# Altium schematic sheet power-supply-hw.SchDoc
size A4; DrawnBy: Rogério J. Marcondeli / Samuel C. Z. Fraga
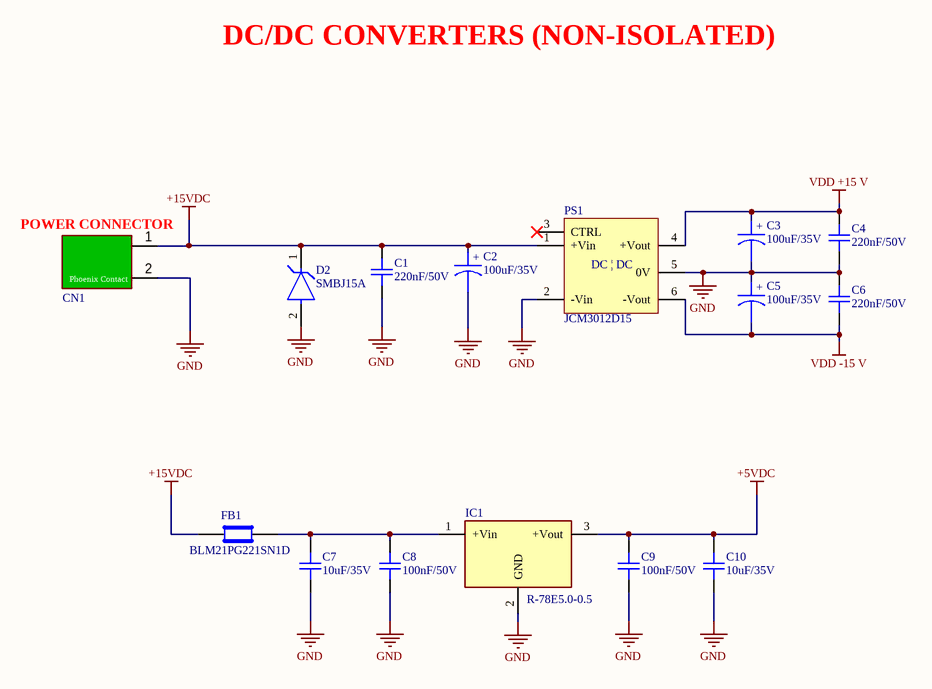
[diagram p0: power-supply-hw.SchDoc]

## Parts
C1  220nF/50V  [C0805]
C2  100uF/35V  [CAP_ALUM_case_D8]
C3  100uF/35V  [CAP_ALUM_case_D8]
C4  220nF/50V  [C0805]
C5  100uF/35V  [CAP_ALUM_case_D8]
C6  220nF/50V  [C0805]
C7  10uF/35V  [C0805]
C8  100nF/50V  [C0805]
C9  100nF/50V  [C0805]
C10  10uF/35V  [C0805]
CN1  1755736  [Conector Phoenix 2 vias 1755736]  (value not drawn)
D2  SMBJ15A  [FP-SMBJ-MFG]
FB1  BLM21PG221SN1D  [Ferrite_Bead_0805]
IC1  R-78E5.0-0.5  [R-78E5.0-0.5]
PS1  JCM3012D15  [JCM30]

## Nets
+5VDC: C9.2 C10.2 IC1.3(+Vout)
+15VDC: C1.2 C2.1(Lid_+) CN1.1 D2.1(C) FB1.1 PS1.1(+Vin)
GND: C1.1 C2.2 C3.2 C4.1 C5.1(Lid_+) C6.1 C7.1 C8.1 C9.1 C10.1 CN1.2 D2.2(A) IC1.2(GND) PS1.2(-Vin) PS1.5(0V)
VDD +15 V: C3.1(Lid_+) C4.2 PS1.4(+Vout)
VDD -15 V: C5.2 C6.2 PS1.6(-Vout)
NetC7_2: C7.2 C8.2 FB1.2 IC1.1(+Vin)

Not connected (* = marked no-connect by the designer): PS1 3(CTRL)*

## Notes on the sheet
- DC/DC CONVERTERS (NON-ISOLATED)
- (near CN1) POWER CONNECTOR
- Authors:
- Title:
- Revision:
- File:
- Project:
- Date:
- Variant:
- Sheet
- of
- DAT - INE - EMI
  Eletrônica e
  Microeletrônica
- (in symbol CAPACITOR 100uF/35V) +
- (in symbol JCM3012D15) DC | DC

## Library data of the parts
C1 C4 C6 = CAPACITOR 220nF/50V: Capacitor 220NF 50V X7R 0805; Manufacturer: Murata; Manufacturer Part Number: GRM21BR71H224MA01L; Tolerance: 20%; Código LNLS: AP112018; Supplier 1: Digi-Key; RoHS: Yes; Category: Ceramic Capacitors; Stock 1: 27774; Pricing 1: 1=0,37000, 10=0,25200, 50=0,16800, 100=0,14270, 500=0,10074, 1000=0,08815 (USD); Mount: Surface Mount; Case/Package: 0805; Case Code (Metric): 2012; Case Code (Imperial): 0805; Min Operating Temperature: -55°C; Max Operating Temperature: 125°C; Package Quantity: 1; Capacitance: 220nF; Packaging: Tape and Reel; Voltage Rating: 50V; Dielectric: X7R; Termination: SMD/SMT; Voltage Rating (DC): 50V; Series: GRM; Construction: Flat; Length: 2mm; Width: 0.049inch; Height: 1.25mm; Thickness: 0.053inch; Depth: 1.25mm; Radiation Hardening: No; Lead Free: Lead Free; RoHS Compliant: Yes; ComponentLink1URL: https://datasheet.ciiva.com/5421/product-5421097.pdf?src-supplier=Mouser; ComponentLink1Description: https://datasheet.ciiva.com/5421/product-5421097.pdf?src-supplier=Mouser; ComponentLink2URL: https://datasheet.ciiva.com/136/partnumbering-e-01-136537.pdf?src-supplier=Digi-Key; ComponentLink2Description: https://datasheet.ciiva.com/136/partnumbering-e-01-136537.pdf?src-supplier=Digi-Key; ComponentLink3URL: https://datasheet.ciiva.com/136/partnumbering-e-01-136536.pdf?src-supplier=Digi-Key; ComponentLink3Description: https://datasheet.ciiva.com/136/partnumbering-e-01-136536.pdf?src-supplier=Digi-Key; ComponentLink4URL: https://datasheet.ciiva.com/136/partnumbering-e-01-136538.pdf?src-supplier=Digi-Key; ComponentLink4Description: https://datasheet.ciiva.com/136/partnumbering-e-01-136538.pdf?src-supplier=Digi-Key; Supplier Part Number 1: 490-1671-1-ND
C2 C3 C5 = CAPACITOR 100uF/35V: Capacitor Alum 100UF 35V 20% SMD - EEE-HAV101XAP; Manufacturer: Panasonic; Capacitance: 100µF; Lifetime @ Temp.: 1000 Hrs @ 105°C; Ripple Current: 84mA; Surface Mount Land Size: 0.260" L x 0.260" W (6.60mm x 6.60mm); Código LNLS: AP105066; Part Number: EEE-HAV101XAP; Supplier 1: Digi-Key; Supplier Part Number 1: PCE4726CT-ND; Value: 100uF; Manufacturer Part Number: EEE-HAV101XAP; RoHS: RoHS Compliant; Category: Capacitors; Stock 1: 1957; Pricing 1: 1=0.63, 50=0.3758, 100=0.3289, 250=0.2584, 500=0.2349 (USD); Packaging: Cut Tape (CT); Tolerance: ±20%; Voltage Rating: 35V; ESR (Equivalent Series Resistance): -; Operating Temperature: -40°C ~ 105°C; Type: -; Applications: Automotive; Impedance: -; Lead Spacing: -; Size / Dimension: 0.248" Dia (6.30mm); Height - Seated (Max): 0.303" (7.70mm); Mounting Type: Surface Mount; Package / Case: Radial, Can - SMD; ComponentLink1URL: http://industrial.panasonic.com/www-cgi/jvcr13pz.cgi?E+PZ+3+ABA0116+EEEHAV101XAP+7+WW; ComponentLink1Description: http://industrial.panasonic.com/www-cgi/jvcr13pz.cgi?E+PZ+3+ABA0116+EEEHAV101XAP+7+WW
C7 C10 = CAPACITOR 10uF/35V: Capacitor 10UF 35V X5R 0805; Manufacturer: TDK; Manufacturer Part Number: C2012X5R1V106K085AC; Dielectric Material: Ceramic; Tolerance: 10%; Código LNLS: AP105062; Supplier 1: Digi-Key; Stock 1: 56135; Pricing 1: 1=0.73, 10=0.519, 100=0.3416, 500=0.253, 1000=0.2151 (USD); Case/Package: 0805; Weight: 0.000194oz; Case Code (Metric): 2012; Case Code (Imperial): 0805; Min Operating Temperature: -55°C; Max Operating Temperature: 85°C; Package Quantity: 1; Packaging: Tape and Reel; Capacitance: 10uF; Voltage Rating: 35V; Dielectric: X5R; Termination: SMD/SMT; Voltage Rating (DC): 35V; Length: 0.079inch; Height: 0.85mm; Width: 0.049inch; Thickness: 0.039inch; REACH SVHC: No SVHC; Lead Free: Lead Free; ComponentLink1URL: https://datasheet.ciiva.com/14894/tdkmlcccaprange-14894527.pdf; ComponentLink1Description: https://datasheet.ciiva.com/14894/tdkmlcccaprange-14894527.pdf; Supplier Part Number 1: 445-14417-1-ND
C8 C9 = CAPACITOR 100nF/50V: Capacitor 0.1UF 50V X7R 0805; Manufacturer 1: Kyocera AVX; Manufacturer Part Number 1: 08055C104KAZ2A; Description 1: Capacitor Ceramic 0.1uF 50V X7R 10% SMD 0805 FlexiTerm 125C Paper T/R; Category 1: Ceramic Capacitors; Capacitance: 100nF; Tolerance: 10%; Temperature Coefficient: 30ppm/°C; Dissipation Factor: 2.5%; Código LNLS: AP106675; Supplier 1: Arrow Electronics; Supplier Part Number 1: 08055C104KAZ2A; RoHS 1: Yes; Stock 1: 28000; Pricing 1: 4000=0,0262 (USD); Mount: Surface Mount,PCB; Case/Package: 0805; Number of Pins: 2; Case Code (Metric): 2012; Case Code (Imperial): 0805; Min Operating Temperature: -55°C; Max Operating Temperature: 125°C; Packaging: Tape and Reel; Voltage Rating (DC): 50V; Dielectric: X7R; Package Quantity: 4000; Series: FLEXITERM®; Voltage Rating: 50V; Termination: SMD/SMT; Voltage: 50V; Features: Soft Termination; Construction: Flat; Length: 2.01mm; Width: 1.25mm; Height: 0.94mm; Depth: 1.25mm; Reach SVHC Compliant: No; Lead Free: Lead Free; RoHS Compliant: Yes; ComponentLink1URL: https://datasheet.ciiva.com/28613/630895-28613376.pdf?src-supplier=Element14; ComponentLink1Description: https://datasheet.ciiva.com/28613/630895-28613376.pdf?src-supplier=Element14; ComponentLink2URL: https://datasheet.ciiva.com/11788/0900766b80dc2409-11788550.pdf?src-supplier=Rs; ComponentLink2Description: https://datasheet.ciiva.com/11788/0900766b80dc2409-11788550.pdf?src-supplier=Rs; ComponentLink3URL: https://datasheet.ciiva.com/30514/2014094-30514066.pdf?src-supplier=Jameco; ComponentLink3Description: https://datasheet.ciiva.com/30514/2014094-30514066.pdf?src-supplier=Jameco; ComponentLink4URL: https://datasheet.ciiva.com/11499/flexiterm-11499901.pdf?src-supplier=Avnet; ComponentLink4Description: https://datasheet.ciiva.com/11499/flexiterm-11499901.pdf?src-supplier=Avnet; ComponentLink5URL: https://datasheet.ciiva.com/5417/cx7r-218113-5417323.pdf?src-supplier=Mouser; ComponentLink5Description: https://datasheet.ciiva.com/5417/cx7r-218113-5417323.pdf?src-supplier=Mouser; ComponentLink6URL: https://datasheet.ciiva.com/28613/630895-28613368.pdf?src-supplier=Element14; ComponentLink6Description: https://datasheet.ciiva.com/28613/630895-28613368.pdf?src-supplier=Element14; ComponentLink7URL: https://datasheet.ciiva.com/151/flexiterm-151512.pdf?src-supplier=Digi-Key; ComponentLink7Description: https://datasheet.ciiva.com/151/flexiterm-151512.pdf?src-supplier=Digi-Key; ComponentLink8URL: https://datasheet.ciiva.com/151/flexiterm-151513.pdf?src-supplier=Digi-Key; ComponentLink8Description: https://datasheet.ciiva.com/151/flexiterm-151513.pdf?src-supplier=Digi-Key; ComponentLink9URL: https://datasheet.ciiva.com/151/flexiterm-151514.pdf?src-supplier=Digi-Key; ComponentLink9Description: https://datasheet.ciiva.com/151/flexiterm-151514.pdf?src-supplier=Digi-Key; ComponentLink10URL: https://datasheet.ciiva.com/14602/70001075-14602617.pdf?src-supplier=Allied+Electronics; ComponentLink10Description: https://datasheet.ciiva.com/14602/70001075-14602617.pdf?src-supplier=Allied+Electronics; ComponentLink11URL: https://datasheet.ciiva.com/16427/cx7r-16427406.pdf?src-supplier=Future+Electronics; ComponentLink11Description: https://datasheet.ciiva.com/16427/cx7r-16427406.pdf?src-supplier=Future+Electronics
CN1 = CONECTOR PHOENIX 2 VIAS 1755736: Manufacturer: Phoenix Contact; Number of Positions: 2; Number of Levels: 1; Pitch: 0.200" (5.08mm); Header Orientation: Vertical; Current - IEC: 12A; Voltage - IEC: 630V; Voltage - UL: 300V; Material Flammability Rating: UL94 V-0; Contact Tail Length: 0.154" (3.90mm); Código LNLS: MT101663; Supplier 1: Digi-Key; Manufacturer Part Number: 1755736; RoHS: RoHS Compliant; Category: Connectors, Interconnects; Stock 1: 11008; Pricing 1: 1=0.59, 10=0.564, 50=0.539, 100=0.5243, 250=0.49, 500=0.4508, 1000=0.4165, 2500=0.3969, 5000=0.3724 (USD); Packaging: Bulk; Part Status: Active; Type: Header, Male Pins, Shrouded (4 Side); Positions Per Level: 2; Plug Wire Entry: -; Termination Style: Solder; Mounting Type: Through Hole; Current - UL: 12A; Wire Gauge or Range - AWG: -; Wire Gauge or Range - mm²: -; Color: Green; Operating Temperature: -; Contact Mating Finish: Tin; Features: -; Ingress Protection: -; Screw Size: -; Torque - Screw: -; Wire Strip Length: -; Contact Material: -; Housing Material: Polyamide (PA), Nylon; Insulation Height: 0.472" (12.00mm); ComponentLink1URL: http://media.digikey.com/pdf/Data%20Sheets/Phoenix%20Contact%20PDFs/1755736.pdf; ComponentLink1Description: http://media.digikey.com/pdf/Data%20Sheets/Phoenix%20Contact%20PDFs/1755736.pdf; Supplier Part Number 1: 277-1150-ND
D2 = CMP-07401-000033-1: TVS DIODE 15VWM 24.4VC SMB; Max Breakdown Voltage: 19.2V; Reverse Standoff Voltage: 15V; Number of Elements: 1; Diode Type: ZENER; Max Reverse Leakage Current: 5uA; Operating Supply Voltage: 3.5V; Element Configuration: Single; Reverse Breakdown Voltage: 16.7V; Peak Pulse Power: 600W; Peak Pulse Current: 24A; Polarity: Unidirectional; Clamping Voltage: 24.4V; ESD Protection: Yes; Test Current: 1mA; Power Line Protection: No; Max Surge Current: 100A; Min Operating Temperature: -55°C; Number of Pins: 2; Case/Package: DO-214AA; Number of Channels: 1; Series: SMBJ; Height: 2.42mm; Resistor Type: Zener; Max Power Dissipation: 600W; REACH SVHC: No SVHC; Package Quantity: 1; Breakdown Voltage: 19.2V; Radiation Hardening: No; Direction: Unidirectional; Number of Unidirectional Channels: 1; Termination: SMD/SMT; Length: 4.57mm; Width: 3.94mm; Packaging: Tape and Reel; Leakage Current: 5uA; RoHS Compliant: Yes; Mount: Surface Mount; Min Breakdown Voltage: 16.7V; Max Operating Temperature: 150°C
FB1 = BLM21PG221SN1D: Ferrite Bead 220 OHM 0805 1LN; Manufacturer 1: Murata; Description 1: Ferrite Beads Multi-Layer 220Ohm 25% 100MHz 2A 45mOhm DCR 0805 Paper T/R; Category 1: Ferrite Beads and Chips; Material: Steel,Ferrite; Impedance: 220R; Tolerance: 25%; Max Current Rating: 2A; Number of Lines: 1; DC Resistance (DCR): 45mR; Test Frequency: 100MHz; Shielding: Unshielded; Código LNLS: AP105046; Supplier 1: Digi-Key; Supplier Part Number 1: 490-1054-2-ND; Manufacturer Part Number 1: BLM21PG221SN1D; RoHS 1: Yes; Stock 1: 2578074; Pricing 1: 4000=0,03608, 8000=0,02744, 28000=0,02352 (USD); Case/Package: 0805; Number of Pins: 2; Core Material: Ferrite; Case Code (Metric): 2012; Case Code (Imperial): 0805; Min Operating Temperature: -55°C; Max Operating Temperature: 125°C; Package Quantity: 1; Packaging: Tape and Reel; Current Rating: 2A; Max DC Current: 2A; Termination: SMD/SMT; DC Current: 2A; Frequency: 100MHz; Number of Circuits: 1; Current: 2A; Series: BLM21P; DC Resistance-Max: 45mR; RMS Current (Irms): 2A; Series Resistance: 45mR; Length: 2mm; Width: 1.25mm; Height: 0.85mm; Depth: 1.25mm; Radiation Hardening: No; RoHS Compliant: Yes; Reach SVHC Compliant: No; Military Standard: Not; Lead Free: Lead Free; ComponentLink1URL: https://datasheet.ciiva.com/30514/1845321-30514028.pdf?src-supplier=Jameco; ComponentLink1Description: https://datasheet.ciiva.com/30514/1845321-30514028.pdf?src-supplier=Jameco; ComponentLink2URL: https://datasheet.ciiva.com/1012/l0110s0100blm21p-1012288.pdf?src-supplier=Digi-Key; ComponentLink2Description: https://datasheet.ciiva.com/1012/l0110s0100blm21p-1012288.pdf?src-supplier=Digi-Key; ComponentLink3URL: https://datasheet.ciiva.com/11799/0900766b81275e31-11799232.pdf?src-supplier=Rs; ComponentLink3Description: https://datasheet.ciiva.com/11799/0900766b81275e31-11799232.pdf?src-supplier=Rs; ComponentLink4URL: https://datasheet.ciiva.com/29348/442529-da-01-en-chip-drossel-0805-220r-2000ma-2-0x1-25mm-29348007.pdf?src-supplier=Conrad; ComponentLink4Description: https://datasheet.ciiva.com/29348/442529-da-01-en-chip-drossel-0805-220r-2000ma-2-0x1-25mm-29348007.pdf?src-supplier=Conrad; ComponentLink5URL: https://datasheet.ciiva.com/8021/1756152-8021596.pdf?src-supplier=Element14; ComponentLink5Description: https://datasheet.ciiva.com/8021/1756152-8021596.pdf?src-supplier=Element14; ComponentLink6URL: https://datasheet.ciiva.com/14122/anblm21p-data-e-14122214.pdf?src-supplier=Distrelec; ComponentLink6Description: https://datasheet.ciiva.com/14122/anblm21p-data-e-14122214.pdf?src-supplier=Distrelec; ComponentLink7URL: https://datasheet.ciiva.com/1012/l0110s0100blm21p-1012287.pdf?src-supplier=Digi-Key; ComponentLink7Description: https://datasheet.ciiva.com/1012/l0110s0100blm21p-1012287.pdf?src-supplier=Digi-Key; ComponentLink8URL: https://datasheet.ciiva.com/1012/l0110s0100blm21p-1012289.pdf?src-supplier=Digi-Key; ComponentLink8Description: https://datasheet.ciiva.com/1012/l0110s0100blm21p-1012289.pdf?src-supplier=Digi-Key; ComponentLink9URL: https://datasheet.ciiva.com/8021/1756152-8021598.pdf?src-supplier=Element14; ComponentLink9Description: https://datasheet.ciiva.com/8021/1756152-8021598.pdf?src-supplier=Element14; ComponentLink10URL: https://datasheet.ciiva.com/3081/l0110s0100blm21p-3081655.pdf?src-supplier=Avnet; ComponentLink10Description: https://datasheet.ciiva.com/3081/l0110s0100blm21p-3081655.pdf?src-supplier=Avnet; ComponentLink11URL: https://datasheet.ciiva.com/16215/l0110s0100blm21p-16215194.pdf?src-supplier=Future+Electronics; ComponentLink11Description: https://datasheet.ciiva.com/16215/l0110s0100blm21p-16215194.pdf?src-supplier=Future+Electronics
IC1 = R-78E5.0-0.5: CONV DC/DC 5V 500MA OUT THRU; Manufacturer: Recom; Power Rating: 2.5W; Min Input Voltage (DC): 7V; Max Input Voltage (DC): 28V; Number of Outputs: 1; Efficiency: 92%; Isolation: Non-Isolated; Max Power Dissipation: 3W; Código LNLS: AP105018; Supplier 1: Digi-Key; Manufacturer Part Number: R-78E5.0-0.5; Stock 1: 10893; Pricing 1: 1=2.7, 5=2.656, 10=2.618, 25=2.5412, 50=2.464, 100=2.387, 250=2.31, 500=2.156 (USD); Mount: Through Hole,PCB; Case/Package: SIP; Number of Pins: 3; Weight: 2g; Min Operating Temperature: -40°C; Max Operating Temperature: 85°C; Nominal Output Voltage: 5V; Max Output Current: 500mA; Output Current: 500mA; Output Voltage: 5V; Output Power: 2.5W; Packaging: Rail/Tube; Min Input Voltage: 7V; Package Quantity: 42; Voltage - Output 1: 5V; Current - Output 1: 500mA; Max Input Voltage: 28V; Max Output Power: 2.5W; Max Output Voltage: 5V; Length: 11.6mm; Height: 10.4mm; Width: 8.5mm; Depth: 11.6mm; REACH SVHC: No SVHC; Lead Free: Lead Free; ComponentLink1URL: https://datasheet.ciiva.com/7618/1518729-7618512.pdf; ComponentLink1Description: https://datasheet.ciiva.com/7618/1518729-7618512.pdf; ComponentLink2URL: https://datasheet.ciiva.com/16366/r-78exx-0-5-16366357.pdf; ComponentLink2Description: https://datasheet.ciiva.com/16366/r-78exx-0-5-16366357.pdf; ComponentLink3URL: https://datasheet.ciiva.com/14155/r78xx-05-eng-datasheet-14155703.pdf; ComponentLink3Description: https://datasheet.ciiva.com/14155/r78xx-05-eng-datasheet-14155703.pdf; ComponentLink4URL: https://datasheet.ciiva.com/25627/0900766b810a2db7-25627246.pdf; ComponentLink4Description: https://datasheet.ciiva.com/25627/0900766b810a2db7-25627246.pdf; ComponentLink5URL: https://datasheet.ciiva.com/2168/r-78exx-0-5-02-2168671.pdf; ComponentLink5Description: https://datasheet.ciiva.com/2168/r-78exx-0-5-02-2168671.pdf; Supplier Part Number 1: 945-1648-5-ND
PS1 = JCM3012D15: DC-DC, 30W, DUAL OUTPUT, 2:1, 1X; Manufacturer: XP Power; Number of Outputs: 2; Voltage - Input (Min): 9V; Voltage - Input (Max): 18V; Voltage - Output 1: 15V; Voltage - Output 2: -15V; Current - Output (Max): 1A, 1A; Voltage - Isolation: 1.6kV (1600V); Efficiency: 90%; Código LNLS: MT103202; Supplier 1: Digi-Key; Manufacturer Part Number: JCM3012D15; RoHS: RoHS Compliant; Category: Power Supplies - Board Mount; Stock 1: 20; Pricing 1: 1=41, 5=39.77, 10=38.54, 25=36.9004, 100=34.697 (USD); Packaging: Tube; Part Status: Active; Type: Isolated Module; Voltage - Output 3: -; Power (Watts) - Manufacture Series: 30W; Applications: ITE (Commercial); Features: Remote On/Off, OVP, SCP; Mounting Type: Through Hole; Package / Case: 6-DIP Module; Size / Dimension: 1.00" L x 1.00" W x 0.41" H (25.4mm x 25.4mm x 10.4mm); Operating Temperature: -40°C ~ 100°C; ComponentLink1URL: http://www.xppower.com/Portals/0/pdfs/SF_JCM30.pdf; ComponentLink1Description: http://www.xppower.com/Portals/0/pdfs/SF_JCM30.pdf; Supplier Part Number 1: 1470-3706-ND